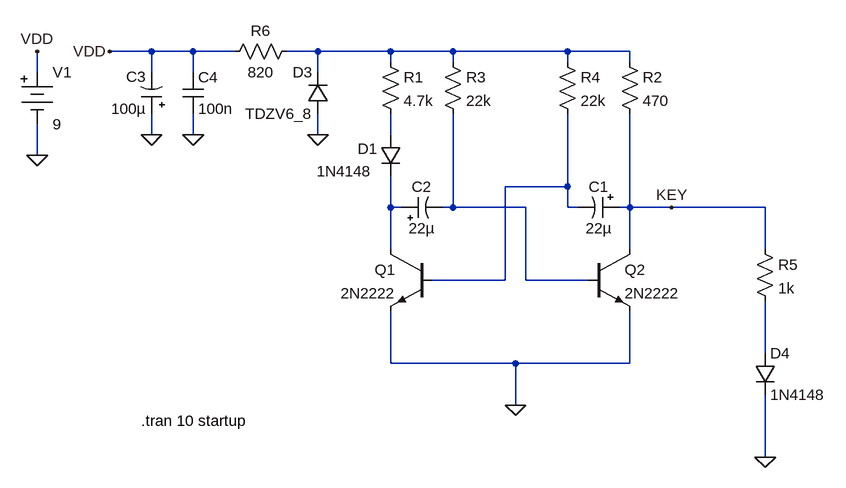
[diagram p0: schematic Draft1.asc]
Draft1.asc, the LTspice schematic file:
Version 4.1
SHEET 1 880 680
WIRE -400 -64 -464 -64
WIRE -336 -64 -400 -64
WIRE -272 -64 -336 -64
WIRE -144 -64 -192 -64
WIRE -32 -64 -144 -64
WIRE 64 -64 -32 -64
WIRE 240 -64 64 -64
WIRE 336 -64 240 -64
WIRE -32 -48 -32 -64
WIRE 64 -48 64 -64
WIRE 240 -48 240 -64
WIRE 336 -48 336 -64
WIRE -576 -32 -576 -64
WIRE -400 -32 -400 -64
WIRE -336 -32 -336 -64
WIRE -144 -32 -144 -64
WIRE -400 64 -400 32
WIRE -336 64 -336 32
WIRE -144 64 -144 32
WIRE -32 64 -32 32
WIRE -576 96 -576 48
WIRE 240 144 240 32
WIRE 240 144 144 144
WIRE -32 176 -32 128
WIRE -16 176 -32 176
WIRE 64 176 64 32
WIRE 64 176 48 176
WIRE 176 176 64 176
WIRE 240 176 240 144
WIRE 256 176 240 176
WIRE 336 176 336 32
WIRE 336 176 320 176
WIRE 400 176 336 176
WIRE 544 176 400 176
WIRE -32 240 -32 176
WIRE 336 240 336 176
WIRE 544 240 544 176
WIRE 144 288 144 144
WIRE 144 288 32 288
WIRE 176 288 176 176
WIRE 272 288 176 288
WIRE 544 400 544 320
WIRE -32 416 -32 336
WIRE 160 416 -32 416
WIRE 336 416 336 336
WIRE 336 416 160 416
WIRE 160 480 160 416
WIRE 544 560 544 464
FLAG 160 480 0
FLAG 400 176 KEY
FLAG -576 -64 VDD
FLAG -576 96 0
FLAG 544 560 0
FLAG -144 64 0
FLAG -464 -64 VDD
FLAG -400 64 0
FLAG -336 64 0
SYMBOL npn 32 240 M0
SYMATTR InstName Q1
SYMATTR Value 2N2222
SYMBOL npn 272 240 R0
SYMATTR InstName Q2
SYMATTR Value 2N2222
SYMBOL res -48 -64 R0
SYMATTR InstName R1
SYMATTR Value 4.7k
SYMBOL res 320 -64 R0
SYMATTR InstName R2
SYMATTR Value 470
SYMBOL res 48 -64 R0
SYMATTR InstName R3
SYMATTR Value 22k
SYMBOL res 224 -64 R0
SYMATTR InstName R4
SYMATTR Value 22k
SYMBOL polcap 320 160 R90
WINDOW 0 0 32 VBottom 2
WINDOW 3 32 32 VTop 2
SYMATTR InstName C1
SYMATTR Value 22µ
SYMBOL polcap -16 192 R270
WINDOW 0 32 32 VTop 2
WINDOW 3 0 32 VBottom 2
SYMATTR InstName C2
SYMATTR Value 22µ
SYMBOL diode -48 64 R0
WINDOW 0 -35 22 Left 2
WINDOW 3 -98 56 Left 2
SYMATTR InstName D1
SYMATTR Value 1N4148
SYMBOL Misc\\battery -576 -48 R0
SYMATTR InstName V1
SYMATTR Value 9
SYMBOL res 528 224 R0
SYMATTR InstName R5
SYMATTR Value 1k
SYMBOL diode -128 32 R180
WINDOW 0 24 64 Left 2
WINDOW 3 24 0 Left 2
SYMATTR InstName D3
SYMATTR Value TDZV6_8
SYMBOL res -176 -80 R90
WINDOW 0 0 56 VBottom 2
WINDOW 3 32 56 VTop 2
SYMATTR InstName R6
SYMATTR Value 820
SYMBOL polcap -384 32 R180
WINDOW 0 24 57 Left 2
WINDOW 3 24 8 Left 2
SYMATTR InstName C3
SYMATTR Value 100µ
SYMBOL diode 528 400 R0
SYMATTR InstName D4
SYMATTR Value 1N4148
SYMBOL cap -352 -32 R0
SYMATTR InstName C4
SYMATTR Value 100n
TEXT -416 504 Left 2 !.tran 10 startup

The netlist it stands for:
* Draft1.asc
Q1 N004 N003 0 0 2N2222
Q2 KEY N005 0 0 2N2222
R1 N001 N002 4.7k
R2 N001 KEY 470
R3 N001 N005 22k
R4 N001 N003 22k
C1 KEY N003 22µ
C2 N004 N005 22µ
D1 N002 N004 1N4148
V1 VDD 0 9
R5 KEY N006 1k
D3 0 N001 TDZV6_8
R6 N001 VDD 820
C3 0 VDD 100µ
D4 N006 0 1N4148
C4 VDD 0 100n
.model D D
.lib standard.dio
.model NPN NPN
.model PNP PNP
.lib standard.bjt
.tran 10 startup
.backanno
.end